# Altium schematic sheet JLinkV9-nano.SchDoc
size A4; SheetNumber: 1; SheetTotal: 1
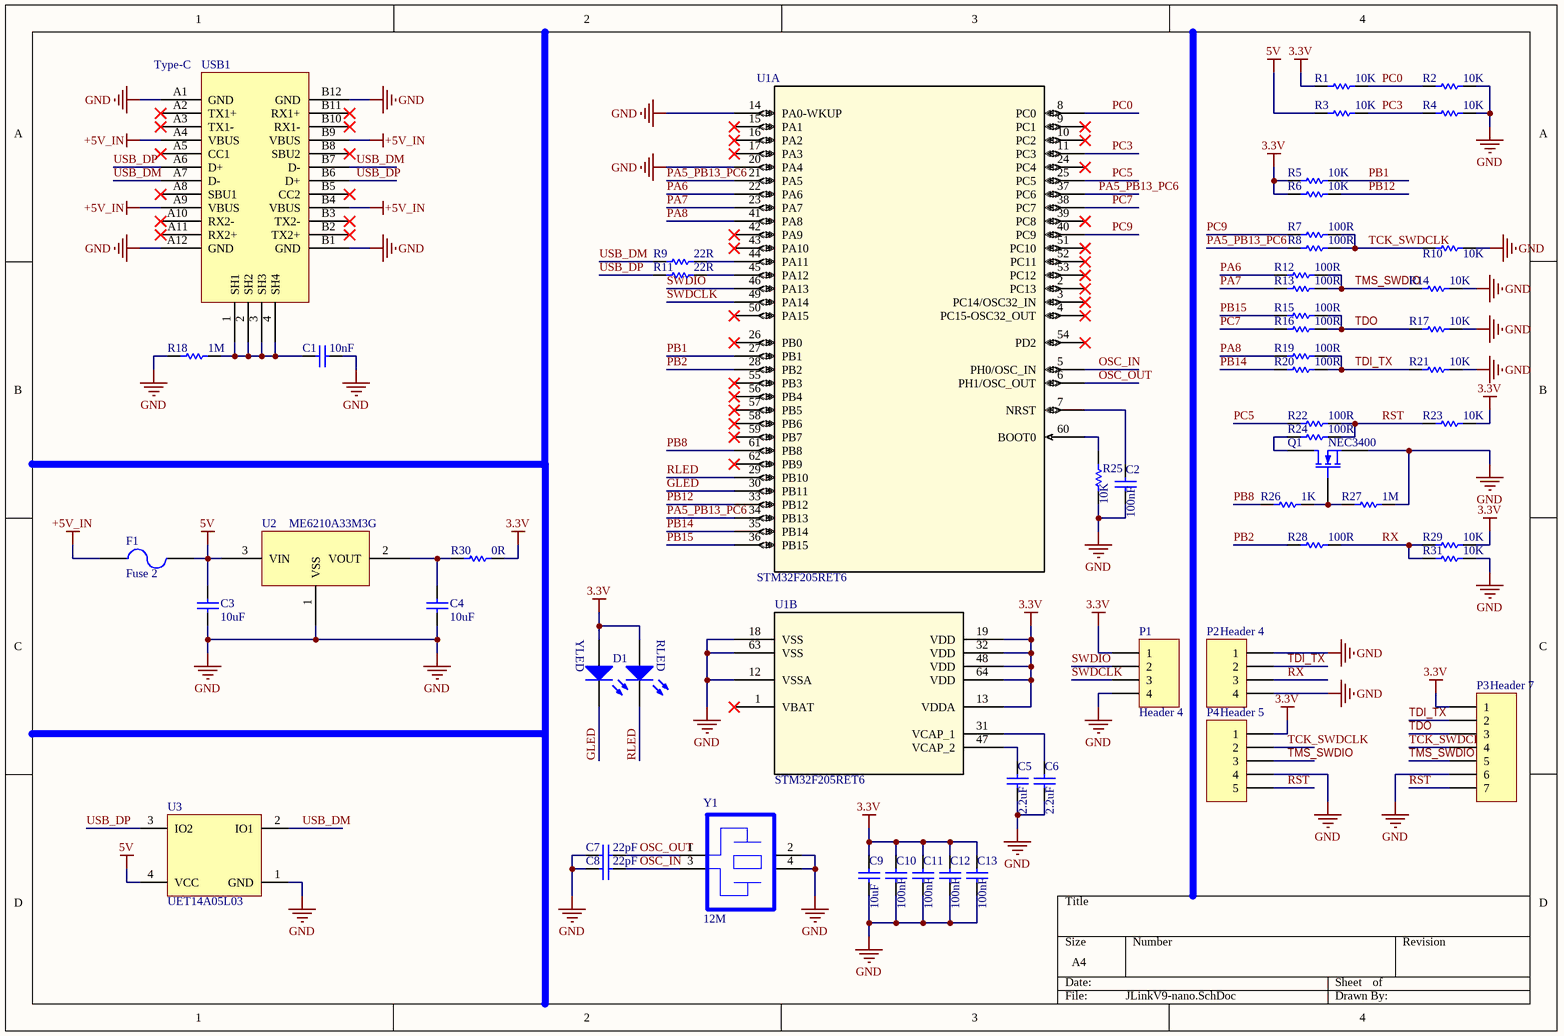
[diagram p0: JLinkV9-nano.SchDoc]

## Parts
C1  value 10nF  [C0402]  (hidden comment: Cap)
C2  value 100nF  [C0402]  (hidden comment: Cap)
C3  value 10uF  [C0603]  (hidden comment: Cap)
C4  value 10uF  [C0603]  (hidden comment: Cap)
C5  value 2.2uF  [C0402]  (hidden comment: Cap)
C6  value 2.2uF  [C0402]  (hidden comment: Cap)
C7  value 22pF  [C0402]  (hidden comment: Cap)
C8  value 22pF  [C0402]  (hidden comment: Cap)
C9  value 10uF  [C0603]  (hidden comment: Cap)
C10  value 100nF  [C0402]  (hidden comment: Cap)
C11  value 100nF  [C0402]  (hidden comment: Cap)
C12  value 100nF  [C0402]  (hidden comment: Cap)
C13  value 100nF  [C0402]  (hidden comment: Cap)
D1  LED2  [LED_2]  (value not drawn)
F1  Fuse 2  [R0603]
P1  Header 4  [2_0MM_4_HEADER]
P2  Header 4  [2_0MM_4_HEADER]
P3  Header 7  [2_0MM_7_HEADER]
P4  Header 5  [2_0MM_5_HEADER]
Q1  NEC3400  [SOT-23_L]
R1  value 10K  [R0402]  (hidden comment: Res)
R2  value 10K  [R0402]  (hidden comment: Res)
R3  value 10K  [R0402]  (hidden comment: Res)
R4  value 10K  [R0402]  (hidden comment: Res)
R5  value 10K  [R0402]  (hidden comment: Res)
R6  value 10K  [R0402]  (hidden comment: Res)
R7  value 100R  [R0402]  (hidden comment: Res)
R8  value 100R  [R0402]  (hidden comment: Res)
R9  value 22R  [R0402]  (hidden comment: Res)
R10  value 10K  [R0402]  (hidden comment: Res)
R11  value 22R  [R0402]  (hidden comment: Res)
R12  value 100R  [R0402]  (hidden comment: Res)
R13  value 100R  [R0402]  (hidden comment: Res)
R14  value 10K  [R0402]  (hidden comment: Res)
R15  value 100R  [R0402]  (hidden comment: Res)
R16  value 100R  [R0402]  (hidden comment: Res)
R17  value 10K  [R0402]  (hidden comment: Res)
R18  value 1M  [R0402]  (hidden comment: Res)
R19  value 100R  [R0402]  (hidden comment: Res)
R20  value 100R  [R0402]  (hidden comment: Res)
R21  value 10K  [R0402]  (hidden comment: Res)
R22  value 100R  [R0402]  (hidden comment: Res)
R23  value 10K  [R0402]  (hidden comment: Res)
R24  value 100R  [R0402]  (hidden comment: Res)
R25  value 10K  [R0402]  (hidden comment: Res)
R26  value 1K  [R0402]  (hidden comment: Res)
R27  value 1M  [R0402]  (hidden comment: Res)
R28  value 100R  [R0402]  (hidden comment: Res)
R29  value 10K  [R0402]  (hidden comment: Res)
R30  value 0R  [R0402]  (hidden comment: Res)
R31  value 10K  [R0402]  (hidden comment: Res)
U1  STM32F205RET6  [LQFP64-10x10mm]  (parts A,B of 2)
U2  ME6210A33M3G  [SOT-23_L]
U3  UET14A05L03  [SOT-143_L]
USB1  Type-C  [USB-Type-C]
Y1  12M  [XTAL4]

## Nets
3.3V: C9.2 C10.2 C11.2 C12.2 C13.2 D1.1(A) D1.3(A) P1.1 P3.1 P4.1 R1.1 R5.1 R6.1 R23.2 R29.2 R30.2 U1.13(VDDA) U1.19(VDD) U1.32(VDD) U1.48(VDD) U1.64(VDD)
5V: C3.2 F1.2 R3.1 U2.3(VIN) U3.4(VCC)
+5V_IN: F1.1 USB1.A4(VBUS) USB1.A9(VBUS) USB1.B4(VBUS) USB1.B9(VBUS)
GND: C1.2 C2.1 C3.1 C4.1 C5.1 C6.1 C7.2 C8.2 C9.1 C10.1 C11.1 C12.1 C13.1 P1.4 P2.1 P2.4 P3.6 P4.4 Q1.3(S) R2.2 R4.2 R10.2 R14.2 R17.2 R18.1 R21.2 R25.1 R27.2 R31.2 U1.12(VSSA) U1.14(PA0-WKUP) U1.18(VSS) U1.20(PA4) U1.63(VSS) U2.1(VSS) U3.1(GND) USB1.A1(GND) USB1.A12(GND) USB1.B1(GND) USB1.B12(GND) Y1.2(GND) Y1.4(GND)
GLED: D1.4(K) U1.30(PB11)
OSC_IN: C8.1 U1.5(PH0/OSC_IN) Y1.3(OSC2)
OSC_OUT: C7.1 U1.6(PH1/OSC_OUT) Y1.1(OSC1)
PA5_PB13_PC6: R8.1 U1.21(PA5) U1.34(PB13) U1.37(PC6)
PA6: R12.1 U1.22(PA6)
PA7: R13.1 U1.23(PA7)
PA8: R19.1 U1.41(PA8)
PB1: R5.2 U1.27(PB1)
PB2: R28.1 U1.28(PB2)
PB8: R26.1 U1.61(PB8)
PB12: R6.2 U1.33(PB12)
PB14: R20.1 U1.35(PB14)
PB15: R15.1 U1.36(PB15)
PC0: R1.2 R2.1 U1.8(PC0)
PC3: R3.2 R4.1 U1.11(PC3)
PC5: R22.1 U1.25(PC5)
PC7: R16.1 U1.38(PC7)
PC9: R7.1 U1.40(PC9)
RLED: D1.2(K) U1.29(PB10)
RST: P3.7 P4.5 R22.2 R23.1 R24.2
RX: P2.3 R28.2 R29.1 R31.1
SWDCLK: P1.3 U1.49(PA14)
SWDIO: P1.2 U1.46(PA13)
TCK_SWDCLK: P3.4 P4.2 R7.2 R8.2 R10.1
TDI_TX: P2.2 P3.2 R19.2 R20.2 R21.1
TDO: P3.3 R15.2 R16.2 R17.1
TMS_SWDIO: P3.5 P4.3 R12.2 R13.2 R14.1
USB_DM: R9.1 U3.2(IO1) USB1.A7(D-) USB1.B7(D-)
USB_DP: R11.1 U3.3(IO2) USB1.A6(D+) USB1.B6(D+)
NetC1_1: C1.1 R18.2 USB1.1(SH1) USB1.2(SH2) USB1.3(SH3) USB1.4(SH4)
NetC2_2: C2.2 U1.7(NRST)
NetC4_2: C4.2 R30.1 U2.2(VOUT)
NetC5_2: C5.2 U1.47(VCAP_2)
NetC6_2: C6.2 U1.31(VCAP_1)
NetQ1_1: Q1.1(D) R24.1
NetQ1_2: Q1.2(G) R26.2 R27.1
NetR9_2: R9.2 U1.44(PA11)
NetR11_2: R11.2 U1.45(PA12)
NetR25_2: R25.2 U1.60(BOOT0)

Not connected (* = marked no-connect by the designer): U1 1(VBAT)* 2(PC13)* 3(PC14/OSC32_IN)* 4(PC15-OSC32_OUT)* 9(PC1)* 10(PC2)* 15(PA1)* 16(PA2)* 17(PA3)* 24(PC4)* 26(PB0)* 39(PC8)* 42(PA9)* 43(PA10)* 50(PA15)* 51(PC10)* 52(PC11)* 53(PC12)* 54(PD2)* 55(PB3)* 56(PB4)* 57(PB5)* 58(PB6)* 59(PB7)* 62(PB9)*; USB1 A2(TX1+)* A3(TX1-)* A5(CC1)* A8(SBU1)* A10(RX2-)* A11(RX2+)* B2(TX2+)* B3(TX2-)* B5(CC2)* B8(SBU2)* B10(RX1-)* B11(RX1+)*

## Notes on the sheet
- (in symbol LED2) YLED; RLED

## Library data of the parts
C1-C13 = Cap: Capacitor; Published: 8-Jun-2000; LatestRevisionDate: 17-Jul-2002; LatestRevisionNote: Re-released for DXP Platform.; PackageReference: RAD-0.3; Publisher: Altium Limited; PackageDescription: Radial Cap, Thru-Hole; 2 Leads; 0.3 in Pin Spacing
D1 = LED2: Typical RED, GREEN, YELLOW, AMBER GaAs LED; Published: 8-Jun-2000; LatestRevisionDate: 17-Jul-2002; LatestRevisionNote: Re-released for DXP Platform.; PackageVersion: Feb-2002; PackageReference: 3.2X1.6X1.1; Publisher: Altium Limited; PackageDescription: SM LED; 2 Flat Leads
F1 = Fuse 2: Fuse; Published: 8-Jun-2000; LatestRevisionDate: 17-Jul-2002; LatestRevisionNote: Re-released for DXP Platform.; PackageReference: PIN-W2/E2.8; Publisher: Altium Limited; PackageDescription: Thru-Hole; 2 Leads
P1 P2 = Header 4: Header, 4-Pin; LatestRevisionDate: 17-Jul-2002; LatestRevisionNote: Re-released for DXP Platform.; Publisher: Altium Limited
P3 = Header 7: Header, 7-Pin; LatestRevisionDate: 17-Jul-2002; LatestRevisionNote: Re-released for DXP Platform.; Publisher: Altium Limited
P4 = Header 5: Header, 5-Pin; LatestRevisionDate: 17-Jul-2002; LatestRevisionNote: Re-released for DXP Platform.; Publisher: Altium Limited
Q1 = MOSFET-N: N-Channel MOSFET; Published: 8-Jun-2000; LatestRevisionDate: 17-Jul-2002; LatestRevisionNote: Re-released for DXP Platform.; PackageVersion: 1995/1996; PackageReference: E3; Publisher: Altium Limited; PackageDescription: TO, Flat Index; 3 In-Line, Axial Leads; Body Dia. 4.6mm; Lead Dia. 0.5 mm (max)
R1-R31 = Res: Resistor; Published: 8-Jun-2000; LatestRevisionDate: 17-Jul-2002; LatestRevisionNote: Re-released for DXP Platform.; PackageReference: AXIAL-0.3; Publisher: Altium Limited; PackageDescription: Axial Device, Thru-Hole; 2 Leads; 0.3 in Pin Spacing
U1 = STM32F205RET6: No Description Available; Mfr_Name: STMicroelectronics; Copyright: Copyright (C) 2021 Ultra Librarian. All rights reserved.; Manufacturer_Part_Number: STM32F205RET6; RefDes: RefDes; Type: DEV
U3 = ESD4
USB1 = USB-TYPE-C
Y1 = XTAL4